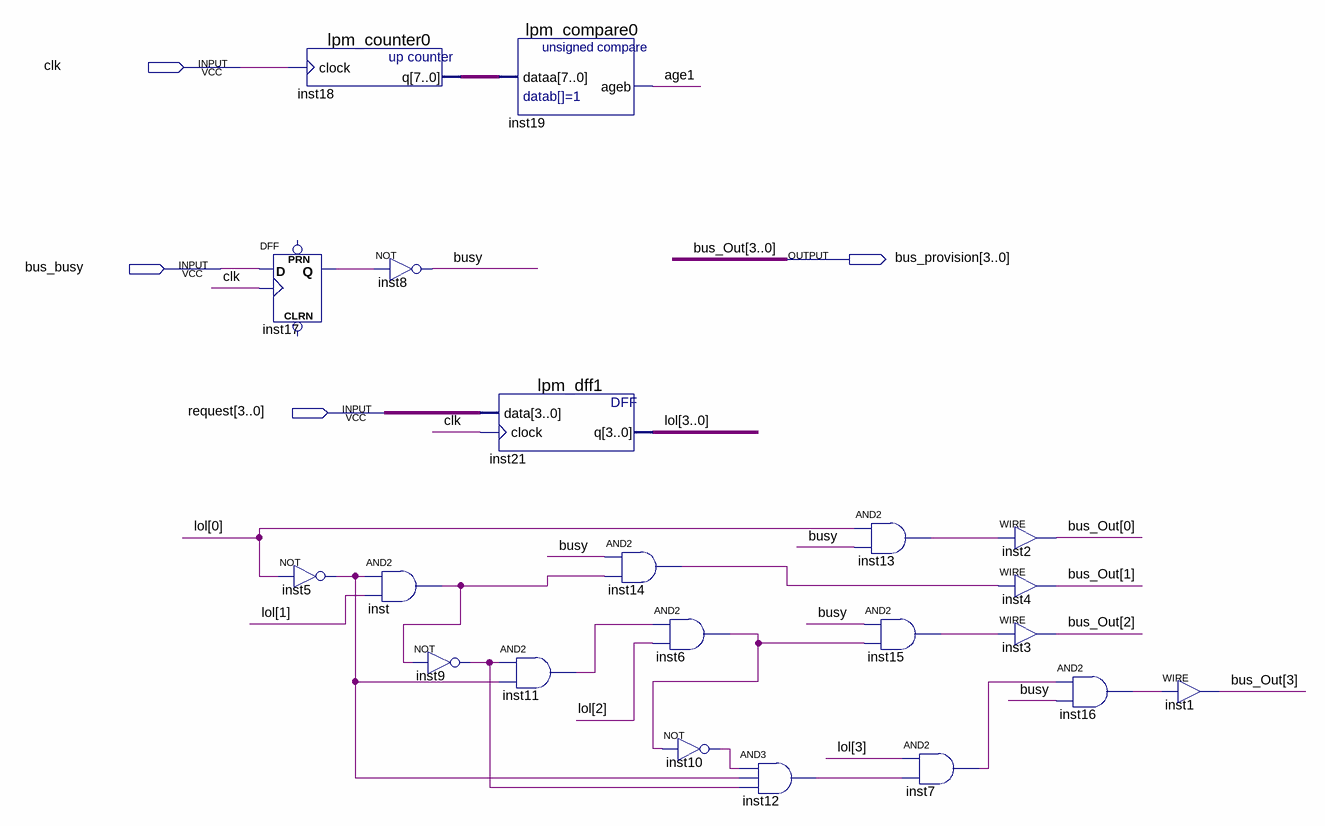
[diagram p0: schematic sheet]
// Quartus schematic Arbitr.bdf as structural Verilog: 21 symbols, 4 pins
module Arbitr (
  input  clk,
  input  bus_busy,
  input  [3:0] request,
  output [3:0] bus_provision
);

  wire age1, busy, inst5_out, inst6_out, inst7_out, inst9_out, inst10_out, inst11_out, inst12_out,
       inst13_out, inst14_out, inst15_out, inst16_out, inst17_q, inst_out;
  wire [3:0] lol;
  wire [7:0] inst18_q;

  DFF inst17 (.CLK(clk), .D(bus_busy), .Q(inst17_q));  // open: CLRN, PRN
  lpm_counter0 inst18 (.clock(clk), .q(inst18_q));
  not inst5 (inst5_out, lol[0]);
  not inst8 (busy, inst17_q);
  and inst (inst_out, inst5_out, lol[1]);
  not inst9 (inst9_out, inst_out);
  lpm_dff1 inst21 (.data(request), .clock(clk), .q(lol));
  lpm_compare0 inst19 (.dataa(inst18_q), .ageb(age1));
  and inst11 (inst11_out, inst9_out, inst5_out);
  and inst14 (inst14_out, busy, inst_out);
  and inst6 (inst6_out, inst11_out, lol[2]);
  not inst10 (inst10_out, inst6_out);
  and inst12 (inst12_out, inst10_out, inst5_out, inst9_out);
  and inst13 (inst13_out, lol[0], busy);
  and inst15 (inst15_out, busy, inst6_out);
  and inst7 (inst7_out, lol[3], inst12_out);
  assign bus_provision[0] = inst13_out;  // WIRE inst2
  assign bus_provision[1] = inst14_out;  // WIRE inst4
  assign bus_provision[2] = inst15_out;  // WIRE inst3
  and inst16 (inst16_out, inst7_out, busy);
  assign bus_provision[3] = inst16_out;  // WIRE inst1

  // Other names for the same wires on the sheet: bus_Out[3:0] = bus_provision
endmodule
